# Altium schematic sheet ETH_IFC.SchDoc: Ethernet Interface
size 420 x 297 mm; Author: G.K.; CompanyName: WUT; DrawnBy: G.K.; Organization: WUT ISE; Address1: Warsaw Univeristy of Technology; Address2: Nowowiejska 15/19; DocumentNumber: 2; SheetNumber: 2; SheetTotal: 3; EDA_Number: ARTIQ; Projet: Booster RF Power Amplifier; ModifiedBy: -; CreateDate: XX/XX/XXXX; CheckedDate: -; Title2: TCP/IP stack + MAC + PHY; DivGrp: ISE; Designer: G.K.; ModifiedDate: -; ProjectName: Booster RF Power Amplifier
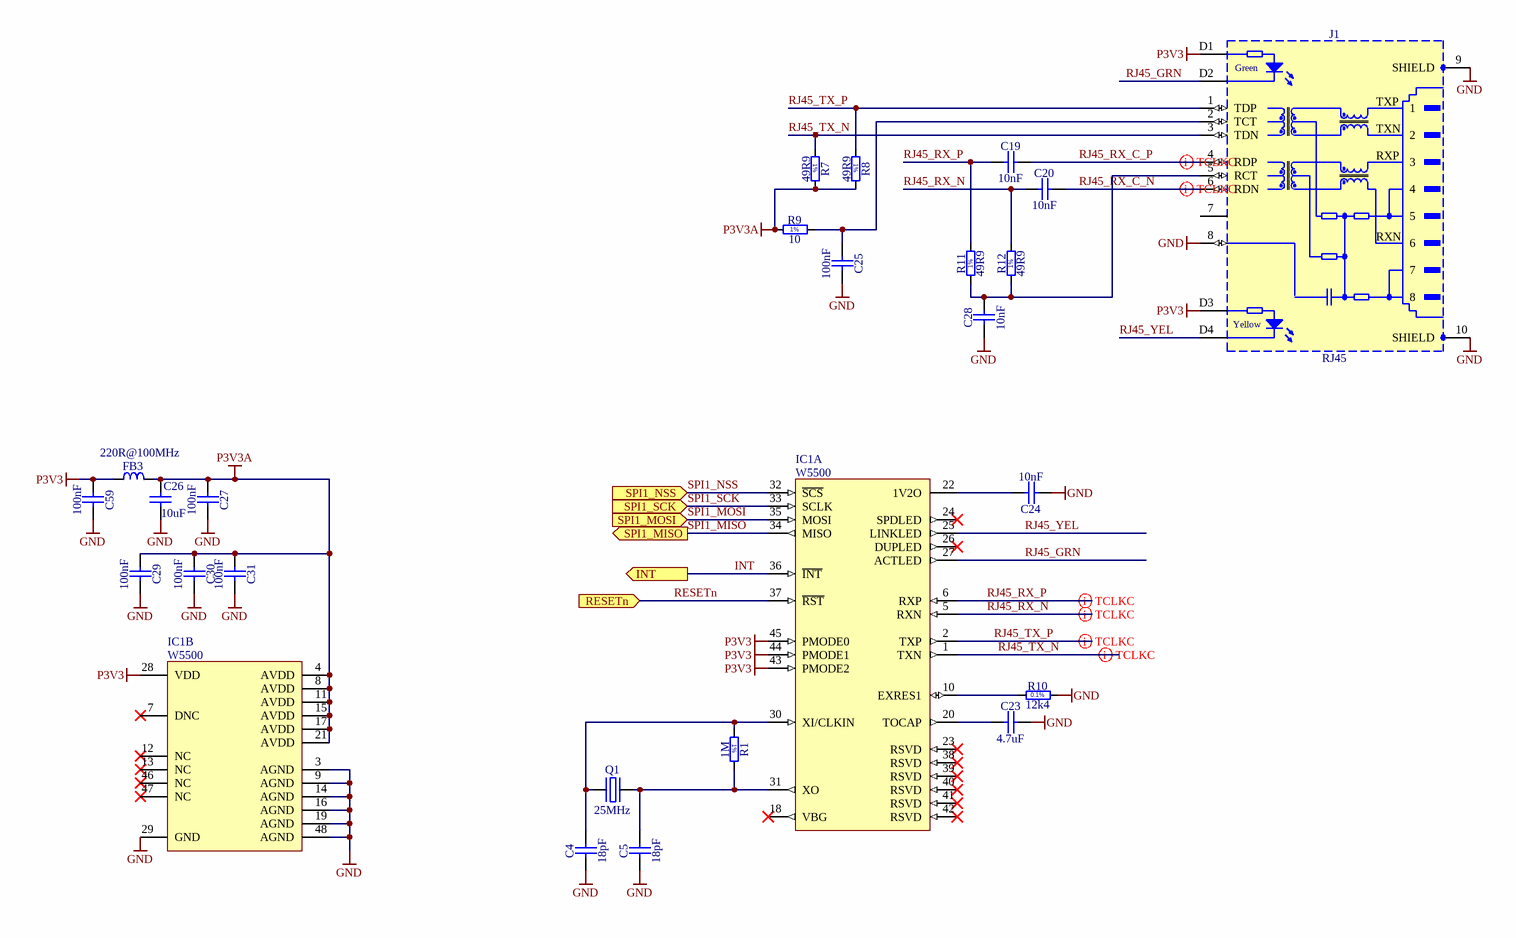
[diagram p0: ETH_IFC.SchDoc]

## Parts
C4  18pF  [CAPC1005X55N]
C5  18pF  [CAPC1005X55N]
C19  10nF  [CAPC1608X87N]
C20  10nF  [CAPC1608X87N]
C23  4.7uF  [CAPC1709X95N]
C24  10nF  [CAPC1608X87N]
C25  100nF  [CAPC1005X55N]
C26  10uF  [CAPC2012X135N]
C27  100nF  [CAPC1005X55N]
C28  10nF  [CAPC1608X87N]
C29  100nF  [CAPC1005X55N]
C30  100nF  [CAPC1005X55N]
C31  100nF  [CAPC1005X55N]
C59  100nF  [CAPC1005X55N]
FB3  220R@100MHz  [INDC2012X105N]
IC1  W5500  [QFP50P900X900X160-48N]  (parts A,B of 2)
J1  RJ45  [TYCO_5-6605308-1]
Q1  25MHz  [XTAL_TXC_AA]
R1  1M  [RESC1005X40N]
R7  49R9  [RESC1005X40N]
R8  49R9  [RESC1005X40N]
R9  10  [RESC1005X40N]
R10  12k4  [RESC1608X55N]
R11  49R9  [RESC1005X40N]
R12  49R9  [RESC1005X40N]

## Ports
INT (out), RESETn (in), SPI1_MISO (out), SPI1_MOSI (in), SPI1_NSS (in), SPI1_SCK (in)

## Nets
GND: C4.1 C5.1 C23.2 C24.1 C25.2 C26.2 C27.2 C28.1 C29.2 C30.2 C31.2 C59.2 IC1.3(AGND) IC1.9(AGND) IC1.14(AGND) IC1.16(AGND) IC1.19(AGND) IC1.29(GND) IC1.48(AGND) J1.8 J1.9(SHIELD) J1.10(SHIELD) R10.2
P3V3: C59.1 FB3.1 IC1.28(VDD) IC1.43(PMODE2) IC1.44(PMODE1) IC1.45(PMODE0) J1.D1 J1.D3
P3V3A: C26.1 C27.1 C29.1 C30.1 C31.1 FB3.2 IC1.4(AVDD) IC1.8(AVDD) IC1.11(AVDD) IC1.15(AVDD) IC1.17(AVDD) IC1.21(AVDD) R7.2 R8.2 R9.1
INT: IC1.36(~{INT}) ; port INT
RESETn: IC1.37(~{RST}) ; port RESETn
RJ45_GRN: IC1.27(ACTLED) J1.D2
RJ45_RX_C_N: C20.2 J1.6(RDN)
RJ45_RX_C_P: C19.2 J1.4(RDP)
RJ45_RX_N: C20.1 IC1.5(RXN) R12.2
RJ45_RX_P: C19.1 IC1.6(RXP) R11.2
RJ45_TX_N: IC1.1(TXN) J1.3(TDN) R7.1
RJ45_TX_P: IC1.2(TXP) J1.1(TDP) R8.1
RJ45_YEL: IC1.25(LINKLED) J1.D4
SPI1_MISO: IC1.34(MISO) ; port SPI1_MISO
SPI1_MOSI: IC1.35(MOSI) ; port SPI1_MOSI
SPI1_NSS: IC1.32(~{SCS}) ; port SPI1_NSS
SPI1_SCK: IC1.33(SCLK) ; port SPI1_SCK
NetC4_2: C4.2 IC1.30(XI/CLKIN) Q1.1(OSC1) R1.1
NetC5_2: C5.2 IC1.31(XO) Q1.2(OSC2) R1.2
NetC23_1: C23.1 IC1.20(TOCAP)
NetC24_2: C24.2 IC1.22(1V2O)
NetC25_1: C25.1 J1.2(TCT) R9.2
NetC28_2: C28.2 J1.5(RCT) R11.1 R12.1
NetIC1_10: IC1.10(EXRES1) R10.1

Not connected (* = marked no-connect by the designer): IC1 7(DNC)* 12(NC)* 13(NC)* 18(VBG)* 23(RSVD)* 24(SPDLED)* 26(DUPLED)* 38(RSVD)* 39(RSVD)* 40(RSVD)* 41(RSVD)* 42(RSVD)* 46(NC)* 47(NC)*; J1 7

## Layout directives
differential pair: RJ45_RX_C_N, RJ45_RX_C_P, RJ45_RX_N, RJ45_RX_P, RJ45_TX_N, RJ45_TX_P

## Notes on the sheet
- Project/Equipment
- Document
- Designer
- Drawn by
- Check.by
- File
- Last Mod.
- Print Date
- Sheet
- Size
- A3
- of
- Rev
- (in symbol R0402_1M_1%_0.0625W_100PPM) 1%
- (in symbol R0402_10R_1%_0.0625W_200PPM) 1%
- (in symbol R0402_49R9_1%_0.0625W_100PPM) 1%
- (in symbol R0603_12K4_0.1%_0.063W_10PPM) 0.1%
- (in symbol TYCO_5-6605308-1) Green; TXP; TXN; RXP; RXN; Yellow

## Library data of the parts
C4 C5 = CC0402_18PF_50V_5%_C0G: Non-polarised capacitor; Part Description: SMD Multilayer Chip Ceramic Capacitor; Manufacturer: GENERIC; Manufacturer1 Part Number: C0402C180J5GACTU; Voltage: 50V; TC: C0G/NP0; Tolerance: ±5%; Part Number: CC0402_18PF_50V_5%_C0G; Component Kind: Standard; Component Type: Standard; Pin Count: 2; Value: 18pF; Status: Preferred; Manufacturer Part Number: CC0402_18PF_50V_5%_C0G; Case: 0402; Mounted: Yes; Socket: No; SMD: Yes; Manufacturer1 Example: KEMET; Manufacturer1 ComponentHeight: 0.55mm; HelpURL: \\cern.ch\dfs\Applications\Altium\Datasheets\CC0402_C0G_KEMET_(Commercial Grade).pdf; Author: CERN DEM JLC; CreateDate: 04.10.2016; LatestRevisionDate: 04.10.2016; Sense: No
C19 C20 C24 C28 = CC0603_10NF_50V_5%_C0G: Non-polarised capacitor; Part Description: SMD Multilayer Chip Ceramic Capacitor; Manufacturer: GENERIC; Manufacturer1 Part Number: C1608C0G1H103J080AA; Voltage: 50V; TC: C0G/NP0; Tolerance: ±5%; Part Number: CC0603_10NF_50V_5%_C0G; Component Kind: Standard; Component Type: Standard; Pin Count: 2; Value: 10nF; Status: Preferred; Manufacturer Part Number: CC0603_10NF_50V_5%_C0G; Case: 0603; Mounted: Yes; Socket: No; SMD: Yes; Sense: No; Manufacturer1 Example: TDK; Manufacturer1 ComponentHeight: 0.9mm; HelpURL: \\cern.ch\dfs\Applications\Altium\Datasheets\CC0603_C0G_TDK_C.pdf; Author: CERN DEM JLC; CreateDate: 10.12.2014; LatestRevisionDate: 10.12.2014
C23 = CC0603_4.7UF_16V_10%_X5R: Non-polarised capacitor; Part Description: SMD Multilayer Chip Ceramic Capacitor; Manufacturer: GENERIC; Manufacturer1 Part Number: EMK107ABJ475KA-T; Voltage: 16V; TC: X5R; Tolerance: ±10%; Part Number: CC0603_4.7UF_16V_10%_X5R; Component Kind: Standard; Component Type: Standard; Pin Count: 2; Value: 4.7uF; Status: None; Manufacturer Part Number: CC0603_4.7UF_16V_10%_X5R; Case: 0603; Mounted: Yes; Socket: No; SMD: Yes; Sense: No; Manufacturer1 Example: TAIYO YUDEN; Manufacturer1 ComponentHeight: 0.95mm; HelpURL: \\cern.ch\dfs\Applications\Altium\Datasheets\CC0603_X7R_TAIYO-YUDEN_HIGH-VALUE.pdf; Author: CERN DEM JLC; CreateDate: 16.12.2013; LatestRevisionDate: 16.09.2014
C25 C27 C29-C31 C59 = CC0402_100NF_16V_10%_X7R: Non-polarised capacitor; Part Description: SMD Multilayer Chip Ceramic Capacitor; Manufacturer: GENERIC; Manufacturer1 Part Number: GRM155R71C104KA88D; Voltage: 16V; TC: X7R; Tolerance: ±10%; Part Number: CC0402_100NF_16V_10%_X7R; Component Kind: Standard; Component Type: Standard; Pin Count: 2; Value: 100nF; Status: Not Recommended; Manufacturer Part Number: CC0402_100NF_16V_10%_X7R; Case: 0402; Mounted: Yes; Socket: No; SMD: Yes; Manufacturer1 Example: MURATA; Manufacturer1 ComponentHeight: 0.55mm; HelpURL: \\cern.ch\dfs\Applications\Altium\Datasheets\CC0402_X7R_MURATA_GRM.pdf; Author: CERN DEM JLC; CreateDate: 05.12.2013; LatestRevisionDate: 03.12.2007; Sense: No
C26 = CC0805_10UF_10V_10%_X7R: Non-polarised capacitor; Part Description: SMD Multilayer Chip Ceramic Capacitor; Manufacturer: GENERIC; Manufacturer1 Part Number: GRM21BR71A106KE51L; Voltage: 10V; TC: X7R; Tolerance: ±10%; Table: Capacitors SMD; Part Number: CC0805_10UF_10V_10%_X7R; Component Kind: Standard; Component Type: Standard; Pin Count: 2; Value: 10uF; Status: Preferred; Manufacturer Part Number: CC0805_10UF_10V_10%_X7R; Case: 0805; Mounted: Yes; Socket: No; SMD: Yes; Manufacturer1 Example: MURATA; Manufacturer1 ComponentHeight: 1.35mm; HelpURL: \\cern.ch\dfs\Applications\Altium\Datasheets\CC0805_X7R_MURATA.pdf; Author: CERN DEM JLC; CreateDate: 2012-04-30; LatestRevisionDate: 2012-04-30
FB3 = IND0805_MURATA_BLM21PG221SN1D: Inductor; Part Description: SMD EMIFIL Suppression Chip Ferrite Bead; Manufacturer: MURATA; Power: 2A; Resistance: 0.05R; Tolerance: ±25%; Table: Inductors SMD; Part Number: IND0805_MURATA_BLM21PG221SN1D; Component Kind: Standard; Component Type: Standard; Pin Count: 2; Value: 220R@100MHz; Status: None; Manufacturer Part Number: BLM21PG221SN1D; Case: 0805; Mounted: Yes; Socket: No; SMD: Yes; ComponentHeight: 1.05mm; HelpURL: \\cern.ch\dfs\Applications\Altium\Datasheets\IND0402_MURATA_BLM21P.pdf; Author: CERN DEM JLC; CreateDate: 2010-01-25; LatestRevisionDate: 2010-01-25
IC1 = W5500: iEthernet W5500 TCP/IP Performance and High Speed SPI Ethernet Controller; Manufacturer: WIZNET; PressFit: No; Bonding: No; Part Number: W5500; Component Kind: Standard; Component Type: Standard; Device: W5500; PackageDescription: QFP, 0.50mm Pitch, Square, 48 Pin, 7.00mm L X 7.00mm W X 1.60mm H Body, IPC Medium Density; Part Description: iEthernet W5500 TCP/IP Performance and High Speed SPI Ethernet Controller; Manufacturer Part Number: W5500; Pin Count: 48; Case: QFP48; Mounted: Yes; Socket: No; SMD: Yes; Sense: No; ComponentHeight: 1.6mm; Author: CERN DEM MR; HelpURL: \\cern.ch\dfs\Applications\Altium\Datasheets\W5500.pdf; CreateDate: 15.02.2018; LatestRevisionDate: 15.02.2018
J1 = TYCO_5-6605308-1: 1 Port, Yellow/Green LEDs, RJ45 10/100Base-T Ethernet, Mag45 Connector Module With Integrated Magnetics; Manufacturer: TYCO ELECTRONICS; PressFit: No; Part Number: TYCO_5-6605308-1; Component Kind: Standard; Component Type: Standard; Pin Count: 14; Family: RJ45; Mounted: Yes; Socket: No; SMD: No; Sense: No; Status: None; Part Description: 1 Port, Yellow/Green LEDs, RJ45 10/100Base-T Ethernet, Mag45 Connector Module With Integrated Magnetics; Manufacturer Part Number: 5-6605308-1; ComponentHeight: 15.24mm; HelpURL: \\cern.ch\dfs\Applications\Altium\Datasheets\TYCO_5-6605308-1.pdf; Author: CERN DEM JLC; CreateDate: 23.08.2012; LatestRevisionDate: 23.08.2012
Q1 = XTAL_25MHZ_TXC_AA-25.000MALE-T: Quartz Crystal; Part Description: Tolerance: ± 30ppm, Stability: ±50ppm, -40°C to +85°C, 8pF, SMD Glass Sealing Crystal, AA Series; Manufacturer: TXC CORPORATION; PressFit: No; Bonding: No; Part Number: XTAL_25MHZ_TXC_AA-25.000MALE-T; Component Kind: Standard; Component Type: Standard; PackageDescription: SMD Glass Seam Sealing Crystal, 2 Pins, 3.20mm L X 5.00mm W, AA Serie; Value: 25MHz; Manufacturer Part Number: AA-25.000MALE-T; Pin Count: 2; Mounted: Yes; Socket: No; SMD: Yes; Sense: No; ComponentHeight: 1.2mm; HelpURL: \\cern.ch\dfs\Applications\Altium\Datasheets\XTAL_TXC_AA.pdf; Author: GK; CreateDate: 28.08.2018; LatestRevisionDate: 28.08.2018
R1 = R0402_1M_1%_0.0625W_100PPM: Resistor - 1%; Part Description: General Purpose Thick Film Chip Resistor; Manufacturer: GENERIC; Manufacturer1 Part Number: 232270671005L; TC: ±100ppm/°C; Part Number: R0402_1M_1%_0.0625W_100PPM; Component Kind: Standard; Component Type: Standard; Pin Count: 2; Value: 1M; Status: Not recommended; Power: 0.0625W; Tolerance: ±1%; Manufacturer Part Number: R0402_1M_1%_0.0625W_100PPM; Case: 0402; Mounted: Yes; Sense: No; Socket: No; SMD: Yes; Manufacturer1 Example: YAGEO PHYCOMP; Manufacturer1 ComponentHeight: 0.4mm; HelpURL: \\cern.ch\dfs\Applications\Altium\Datasheets\R0402_Phycomp_RC0402.pdf; Author: CERN DEM JLC; CreateDate: 03.12.2007; LatestRevisionDate: 17.10.2012
R7 R8 R11 R12 = R0402_49R9_1%_0.0625W_100PPM: Resistor - 1%; Part Description: General Purpose Thick Film Chip Resistor; Manufacturer: GENERIC; Manufacturer1 Part Number: 232270674999L or RC0402FR-0749R9L; TC: ±100ppm/°C; Table: Resistors SMD; Part Number: R0402_49R9_1%_0.0625W_100PPM; Component Kind: Standard; Component Type: Standard; Pin Count: 2; Value: 49R9; Status: Not recommended; Power: 0.0625W; Tolerance: ±1%; Manufacturer Part Number: R0402_49R9_1%_0.0625W_100PPM; Case: 0402; Mounted: Yes; Socket: No; SMD: Yes; Manufacturer1 Example: YAGEO PHYCOMP; Manufacturer1 ComponentHeight: 0.4mm; HelpURL: \\cern.ch\dfs\Applications\Altium\Datasheets\R0402_Phycomp_RC0402.pdf; Author: CERN DEM JLC; CreateDate: 2012-10-24; LatestRevisionDate: 2012-10-24
R9 = R0402_10R_1%_0.0625W_200PPM: Resistor - 1%; Part Description: General Purpose Thick Film Chip Resistor; Manufacturer: GENERIC; Manufacturer1 Part Number: 232270671009L; TC: ±200ppm/°C; Part Number: R0402_10R_1%_0.0625W_200PPM; Component Kind: Standard; Component Type: Standard; Pin Count: 2; Value: 10; Status: Not recommended; Power: 0.0625W; Tolerance: ±1%; Manufacturer Part Number: R0402_10R_1%_0.0625W_200PPM; Case: 0402; Mounted: Yes; Sense: No; Socket: No; SMD: Yes; Manufacturer1 Example: YAGEO PHYCOMP; Manufacturer1 ComponentHeight: 0.4mm; HelpURL: \\cern.ch\dfs\Applications\Altium\Datasheets\R0402_Phycomp_RC0402.pdf; Author: CERN DEM JLC; CreateDate: 24.06.2009; LatestRevisionDate: 17.10.2012
R10 = R0603_12K4_0.1%_0.063W_10PPM: Resistor - 0.1%; Part Description: Thin Film Chip Resistor; Manufacturer: GENERIC; Manufacturer1 Part Number: RN73C1J12K4BTDF; Power: 0.063W; TC: ±10ppm; Part Number: R0603_12K4_0.1%_0.063W_10PPM; Component Kind: Standard; Component Type: Standard; Pin Count: 2; Value: 12k4; Status: Not recommended; Tolerance: ±0.1%; Manufacturer Part Number: R0603_12K4_0.1%_0.063W_10PPM; Case: 0603; Mounted: Yes; Sense: No; Socket: No; SMD: Yes; Manufacturer1 Example: TYCO HOLSWORTHY; Manufacturer1 ComponentHeight: 0.5mm; HelpURL: \\cern.ch\dfs\Applications\Altium\Datasheets\R0603_Tyco_RN73.pdf; Author: CERN DEM JLC; CreateDate: 03.12.2007; LatestRevisionDate: 13.03.2008